# Altium schematic sheet POWER SUPPLY.SchDoc
size A4; SheetNumber: 4; SheetTotal: 31
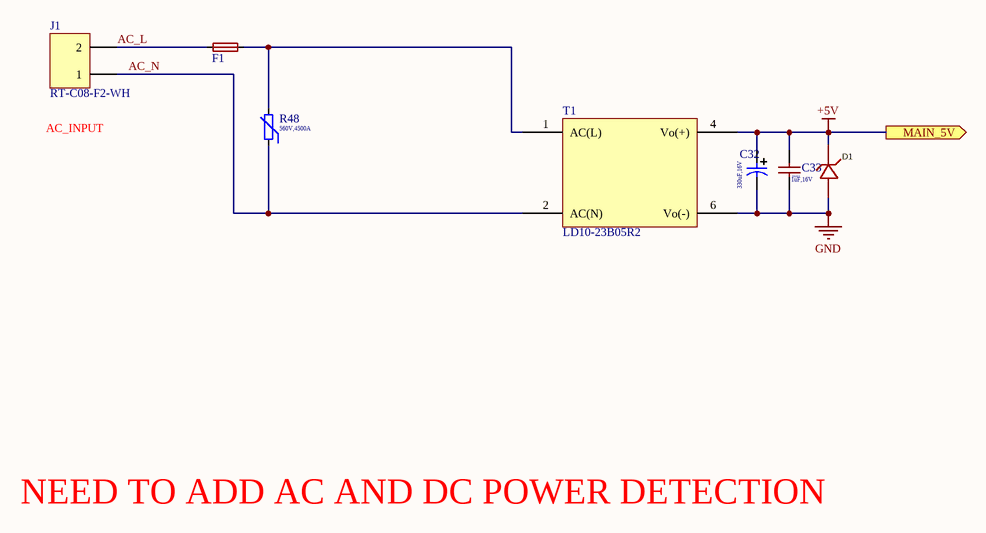
[diagram p0: POWER SUPPLY.SchDoc]

## Parts
C32  value 330uF,16V  [D10xL10.2mm]  (hidden comment: 330uF)
C33  value 1uF,16V  Package: 0603  [C0603]  (hidden comment: 1uF)
D1  SMBJ7.0A  [SMB(DO-214AA)]  (value not drawn)
F1  2009T2A250V  [F1]  (value not drawn)
J1  RT-C08-F2-WH  [AC POWER PORT]
R48  560V,4500A  [DIP-2(VR)]
T1  LD10-23B05R2  [DIP-4(LD10-23B05R2)]

## Ports
MAIN_5V (out)

## Nets
+5V: C32.1 C33.2 D1.1(C) T1.4(Vo(+)) ; port MAIN_5V
GND: C32.2 C33.1 D1.2(A) T1.6(Vo(-))
AC_L: F1.1 J1.2
AC_N: J1.1 R48.1 T1.2(AC(N))
NetF1_2: F1.2 R48.2 T1.1(AC(L))

## Notes on the sheet
- (near J1) AC_INPUT
- NEED TO ADD AC AND DC POWER DETECTION

## Library data of the parts
C32 = VUX331M1CTR-1010: 330uF 16V ±20% SMD,D10xL10mm Aluminum Electrolytic Capacitors - SMD ROHS; Manufacturer: Lelon; MPN: VUX331M1CTR-1010; Datasheet: https://www.lcsc.com/datasheet/lcsc_datasheet_2206301900_Lelon-VUX331M1CTR-1010_C3029698.pdf; LCSC: C3029698; Package: D10xL10mm
C33 = CL10B105KO8NNNC: 16V 1uF X7R ±10% 0603 Multilayer Ceramic Capacitors MLCC - SMD/SMT ROHS; Manufacturer: Samsung Electro-Mechanics; Datasheet: https://www.lcsc.com/datasheet/lcsc_datasheet_2304140030_Samsung-Electro-Mechanics-CL10B105KO8NNNC_C59782.pdf; LCSC: C59782; MPN: CL10B105KO8NNNC
D1 = SMBJ7.0A: 50A 12V 7.78V Unidirectional 7V SMB(DO-214AA) ESD and Surge Protection (TVS/ESD) ROHS; Manufacturer: FTR; Type: TVS; MPN: SMBJ7.0A; Package: SMB(DO-214AA); Datasheet: https://atta.szlcsc.com/upload/public/pdf/source/20200702/C693543_689073A8B3600FE22ABFFC0DC1402DD2.pdf; Reverse Stand-Off Voltage (Vrwm): 7V; Peak Pulse Current (Ipp)@10/1000us: 50A
F1 = 2009T2A250V: Plugin Fuses ROHS; Manufacturer: Hongda; Datasheet: https://datasheet.lcsc.com/lcsc/2009092033_Hongda-2009T2A250V_C529788.pdf; LCSC: C529788; MPN: 2009T2A250V
J1 = RT-C08-F2-WH: Plugin AC Power Connectors ROHS; Manufacturer: Legion; Datasheet: https://www.lcsc.com/datasheet/lcsc_datasheet_2311101854_Legion-RT-C08-F2-WH_C19190827.pdf; LCSC: C19190827; MPN: RT-C08-F2-WH
R48 = 14D561K: 560 V 4.5 kA Varistor 1 Circuit Through Hole Disc 14mm; Manufacturer: Shenzhen Ruilongyuan Electronics Co.Ltd; Datasheet: https://www.digikey.com/en/supplier-centers/shenzhen-ruilongyuan-electronics; MPN: 14D561K; LCSC: C113245; Value: 560V,4500A
T1 = LD10-23B05R2: Power supply module,Power Supplies ROHS; Manufacturer: LZTEC; Input voltage: 85~305VAC; MPN: LD10-23B05R2; LCSC: C20618067